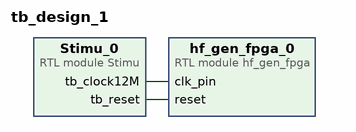
[diagram p0: block diagram of the top level]
# Vivado block design tb_design_1, xc7a35tcpg236-1, Vivado 2024.2
create_bd_design tb_design_1

create_bd_cell -type module -reference Stimu Stimu_0
create_bd_cell -type module -reference hf_gen_fpga hf_gen_fpga_0

# ---- connections ----

connect_bd_net [get_bd_pins Stimu_0/tb_clock12M] [get_bd_pins hf_gen_fpga_0/clk_pin]
connect_bd_net [get_bd_pins Stimu_0/tb_reset] [get_bd_pins hf_gen_fpga_0/reset]

validate_bd_design
save_bd_design
